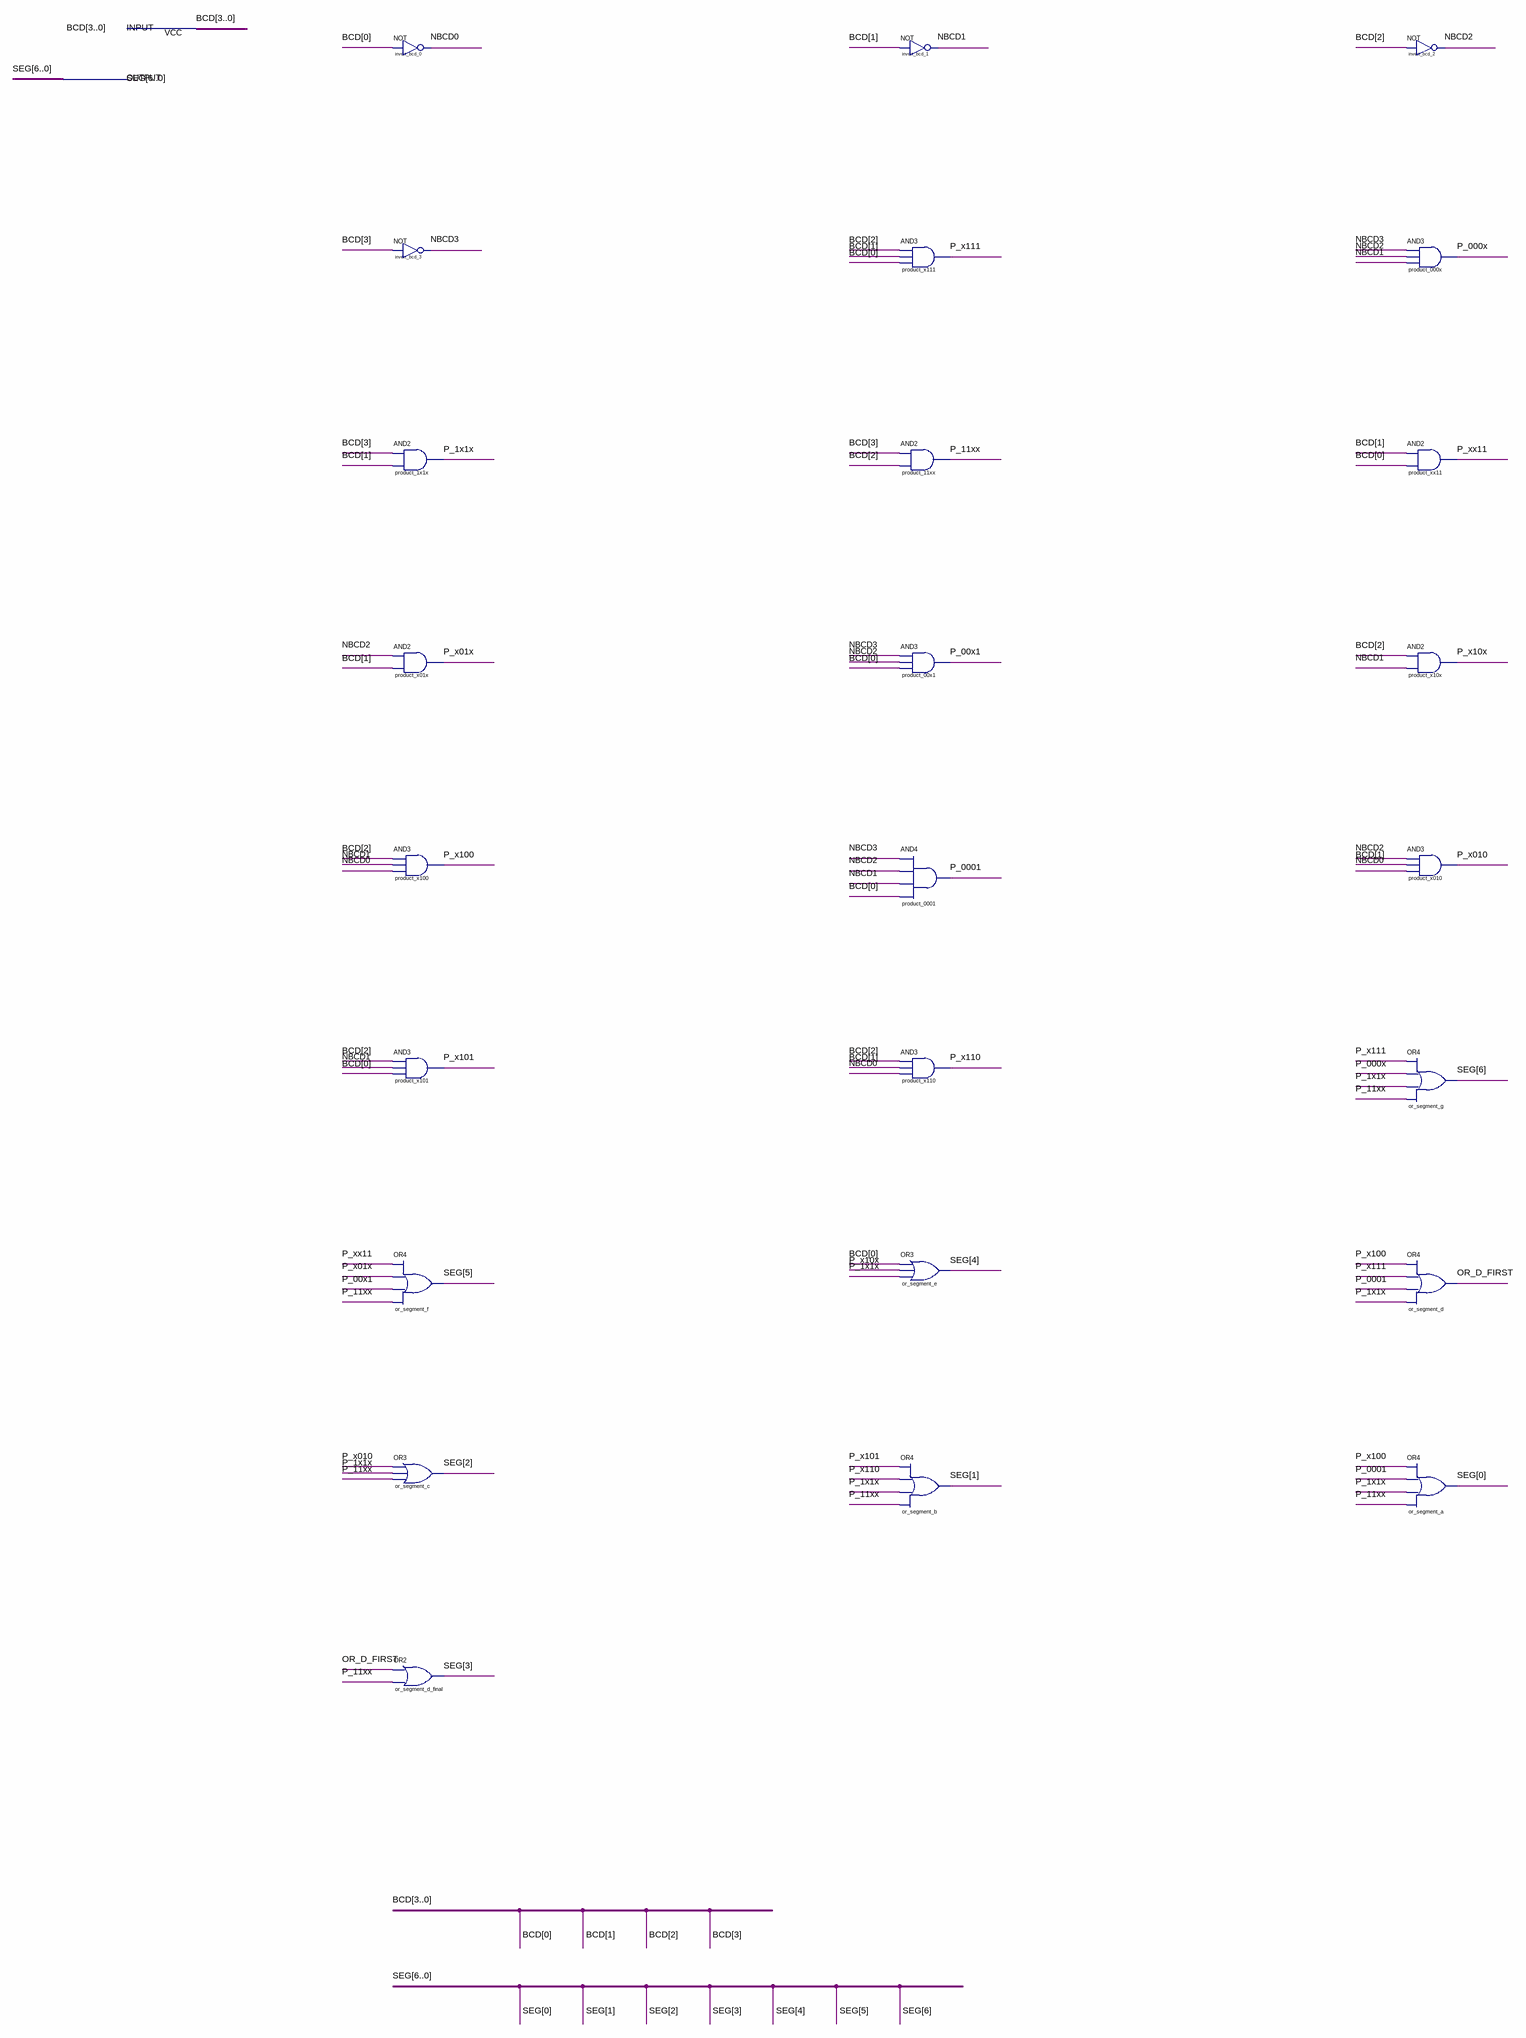
[diagram p0: schematic sheet]
// Quartus schematic bcd_7seg.bdf as structural Verilog: 25 symbols, 2 pins
module bcd_7seg (
  input  [3:0] BCD,
  output [6:0] SEG
);

  wire NBCD0, NBCD1, NBCD2, NBCD3, OR_D_FIRST, P_000x, P_00x1, P_0001, P_1x1x, P_11xx, P_x01x, P_x010,
       P_x10x, P_x100, P_x101, P_x110, P_x111, P_xx11;

  not invert_bcd_0 (NBCD0, BCD[0]);
  not invert_bcd_3 (NBCD3, BCD[3]);
  and product_1x1x (P_1x1x, BCD[3], BCD[1]);
  and product_x01x (P_x01x, NBCD2, BCD[1]);
  and product_x100 (P_x100, BCD[2], NBCD1, NBCD0);
  and product_x101 (P_x101, BCD[2], NBCD1, BCD[0]);
  or or_segment_f (SEG[5], P_xx11, P_x01x, P_00x1, P_11xx);
  or or_segment_c (SEG[2], P_x010, P_1x1x, P_11xx);
  or or_segment_d_final (SEG[3], OR_D_FIRST, P_11xx);
  not invert_bcd_1 (NBCD1, BCD[1]);
  and product_x111 (P_x111, BCD[2], BCD[1], BCD[0]);
  and product_11xx (P_11xx, BCD[3], BCD[2]);
  and product_00x1 (P_00x1, NBCD3, NBCD2, BCD[0]);
  and product_0001 (P_0001, NBCD3, NBCD2, NBCD1, BCD[0]);
  and product_x110 (P_x110, BCD[2], BCD[1], NBCD0);
  or or_segment_e (SEG[4], BCD[0], P_x10x, P_1x1x);
  or or_segment_b (SEG[1], P_x101, P_x110, P_1x1x, P_11xx);
  not invert_bcd_2 (NBCD2, BCD[2]);
  and product_000x (P_000x, NBCD3, NBCD2, NBCD1);
  and product_xx11 (P_xx11, BCD[1], BCD[0]);
  and product_x10x (P_x10x, BCD[2], NBCD1);
  and product_x010 (P_x010, NBCD2, BCD[1], NBCD0);
  or or_segment_g (SEG[6], P_x111, P_000x, P_1x1x, P_11xx);
  or or_segment_d (OR_D_FIRST, P_x100, P_x111, P_0001, P_1x1x);
  or or_segment_a (SEG[0], P_x100, P_0001, P_1x1x, P_11xx);
endmodule
